# Altium schematic sheet drvoutput4.SchDoc
size A4
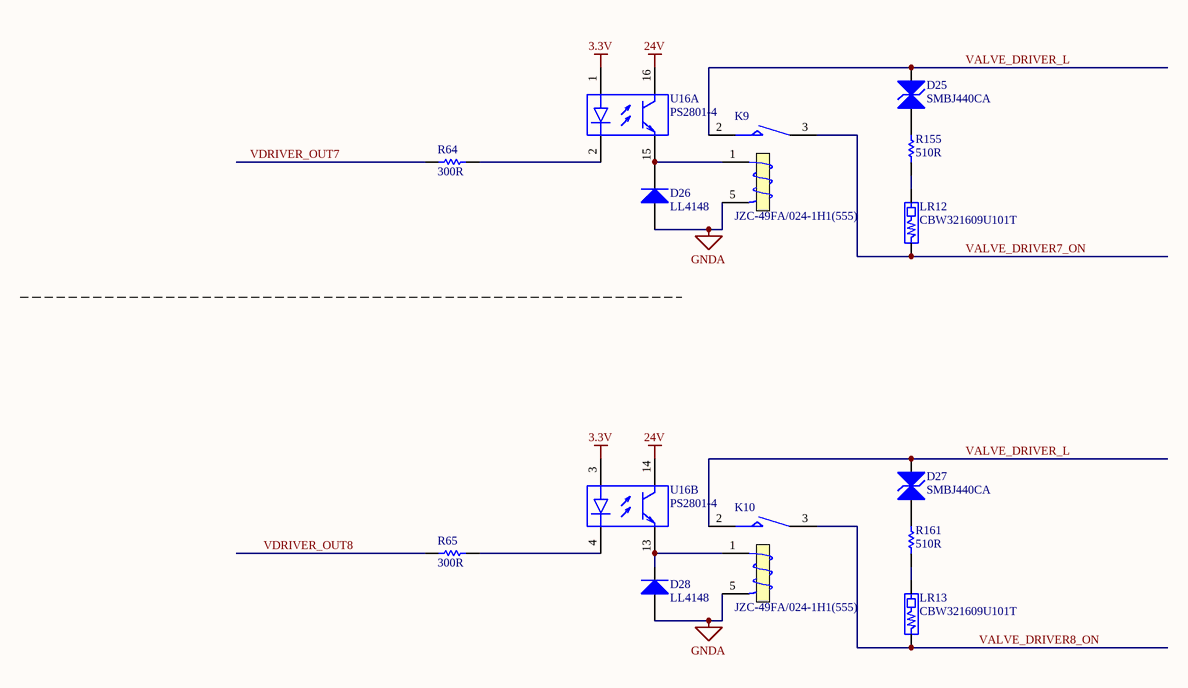
[diagram p0: drvoutput4.SchDoc]

## Parts
D25  SMBJ440CA  [SMB]
D26  LL4148  [CD2012-0805]
D27  SMBJ440CA  [SMB]
D28  LL4148  [CD2012-0805]
K9  JZC-49FA/024-1H1(555)  [JZC-49FA]
K10  JZC-49FA/024-1H1(555)  [JZC-49FA]
LR12  CBW321609U101T  [INDC3216M]
LR13  CBW321609U101T  [INDC3216M]
R64  300R  [RESC2012M]
R65  300R  [RESC2012M]
R155  510R  [RESC3216M]
R161  510R  [RESC3216M]
U16  PS2801-4  [SOIC16_N]  (parts A,B of 4)

## Nets
3.3V: U16.1(+) U16.3(+)
24V: U16.14(C) U16.16(C)
GNDA: D26.1(A) D28.1(A) K9.5(T2) K10.5(T2)
VALVE_DRIVER7_ON: K9.3(NO) LR12.1
VALVE_DRIVER8_ON: K10.3(NO) LR13.1
VALVE_DRIVER_L: D25.2(K) D27.2(K) K9.2(COM) K10.2(COM)
VDRIVER_OUT7: R64.1
VDRIVER_OUT8: R65.1
NetD25_1: D25.1(A) R155.2
NetD26_2: D26.2(K) K9.1 U16.15(E)
NetD27_1: D27.1(A) R161.2
NetD28_2: D28.2(K) K10.1 U16.13(E)
NetLR12_2: LR12.2 R155.1
NetLR13_2: LR13.2 R161.1
NetR64_2: R64.2 U16.2(-)
NetR65_2: R65.2 U16.4(-)

## Library data of the parts
D25 D27 = Bi-dir TVS Diode: Published: 8-Jun-2000; LatestRevisionDate: 17-Jul-2002; LatestRevisionNote: Re-released for DXP Platform.; PackageReference: DIODE-0.7; Publisher: Altium Limited
D26 D28 = Diode 1N4007: 1 Amp General Purpose Rectifier; Published: 8-Jun-2000; LatestRevisionDate: 17-Jul-2002; LatestRevisionNote: Re-released for DXP Platform.; DatasheetVersion: 1998; PackageVersion: Aug-1999; PackageReference: DO-41; Publisher: Altium Limited; Code_JEDEC: DO-204-AL; ComponentLink1Description: Manufacturer Link; ComponentLink1URL: http://www.fairchildsemi.com/; ComponentLink2Description: Datasheet; ComponentLink2URL: http://www.fairchildsemi.com/ds/1N%2F1N4001.pdf
K9 K10 = JZC-49FA: Intermediate  Power  Relay; Published: 8-Jun-2000; LatestRevisionDate: 17-Jul-2002; LatestRevisionNote: Re-released for DXP Platform.; PackageReference: MODULE5B; Publisher: Altium Limited
LR12 LR13 = BLM10/11/21/31/41: EMI FILTERS,DC Resistance max.0.05~1.5 ohms,10 ~ 1000 ohms at 100MHz  Frequency
R64 R65 = Res1: Resistor; Value: 10K; Published: 8-Jun-2000; LatestRevisionDate: 17-Jul-2002; LatestRevisionNote: Re-released for DXP Platform.; PackageReference: AXIAL-0.3; Publisher: Altium Limited
R155 R161 = Res1: Metal film Resistor; Value: 10K; Published: 8-Jun-2000; LatestRevisionDate: 17-Jul-2002; LatestRevisionNote: Re-released for DXP Platform.; PackageReference: AXIAL-0.3; Publisher: Altium Limited
U16 = PS2801-4: The PS2801-1 and PS2801-4 are optically coupled isolators containing a GaAs light emitting diode and an NPN  silicon phototransistor in a plastic SOP for high density applications.; Published: 28-Feb-2003; LatestRevisionDate: 13-Apr-2006; LatestRevisionNote: IPC-7351 Footprint Added.; DatasheetVersion: Jan-2002, Rev. 7; PackageVersion: rev7, Jan-2002; PackageReference: 751-07; Publisher: Altium Limited; PackageDescription: 8-Pin Plastic Small Outline Integrated Circuit 1.27 mm Pitch; Code_JEDEC: MS-012-AA; Code_IPC: SOIC127P600-8; ComponentLink1Description: Manufacturer Link; ComponentLink1URL: http://www.onsemi.com/; ComponentLink2Description: Datasheet; ComponentLink2URL: http://www.onsemi.com/pub/Collateral/LM358-D.PDF